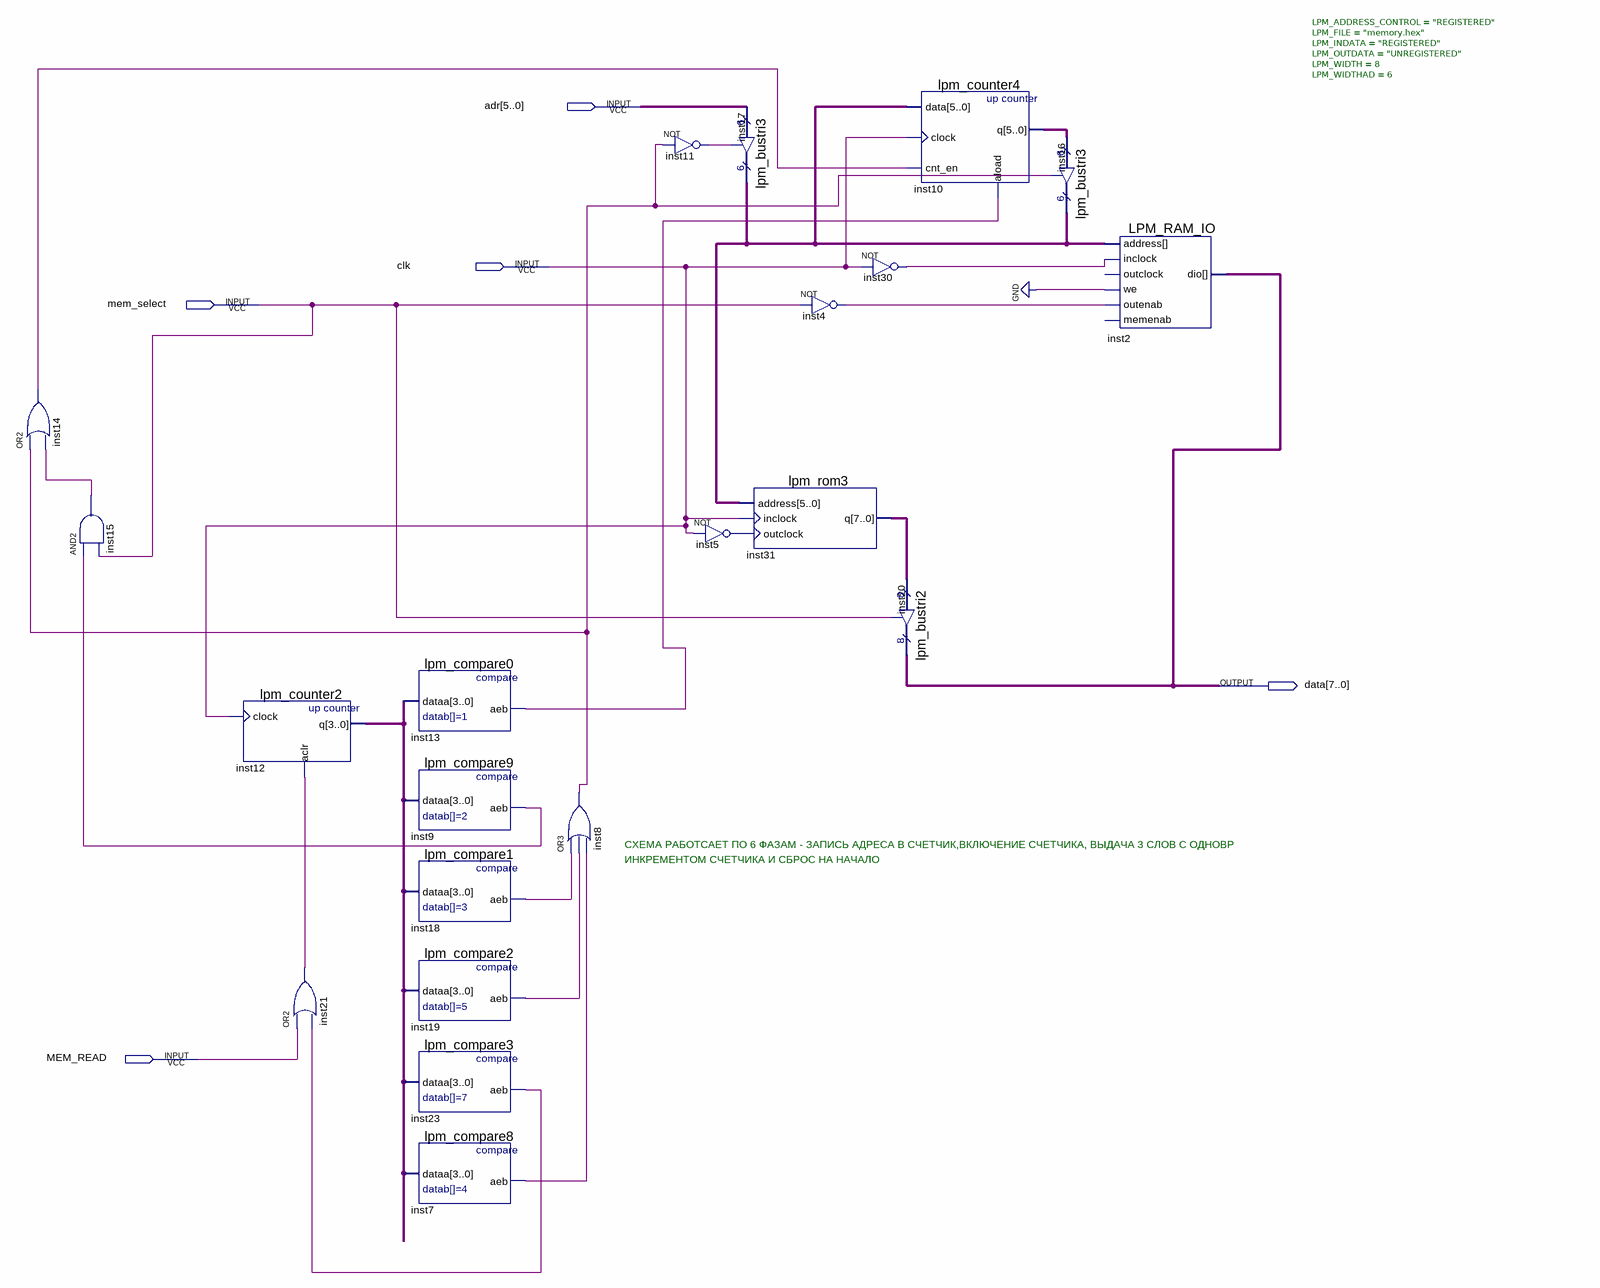
[diagram p0: schematic sheet]
// Quartus schematic memory.bdf as structural Verilog: 21 symbols, 5 pins
module memory (
  input  [5:0] adr,
  input  clk,
  input  mem_select,
  input  MEM_READ,
  output [7:0] data
);

  wire inst4_out, inst5_out, inst7_aeb, inst8_out, inst9_aeb, inst11_out, inst13_aeb, inst14_out, inst15_out,
       inst18_aeb, inst19_aeb, inst21_out, inst23_aeb, inst30_out;
  wire [3:0] inst12_q;
  wire [5:0] inst10_q, inst17_tridata;
  wire [7:0] inst31_q;

  or inst14 (inst14_out, inst8_out, inst15_out);
  and inst15 (inst15_out, inst9_aeb, mem_select);
  lpm_counter2 inst12 (.clock(clk), .aclr(inst21_out), .q(inst12_q));
  or inst21 (inst21_out, MEM_READ, inst23_aeb);
  lpm_compare0 inst13 (.dataa(inst12_q), .aeb(inst13_aeb));
  lpm_compare9 inst9 (.dataa(inst12_q), .aeb(inst9_aeb));
  lpm_compare1 inst18 (.dataa(inst12_q), .aeb(inst18_aeb));
  lpm_compare2 inst19 (.dataa(inst12_q), .aeb(inst19_aeb));
  lpm_compare3 inst23 (.dataa(inst12_q), .aeb(inst23_aeb));
  lpm_compare8 inst7 (.dataa(inst12_q), .aeb(inst7_aeb));
  or inst8 (inst8_out, inst18_aeb, inst19_aeb, inst7_aeb);
  not inst11 (inst11_out, inst8_out);
  lpm_bustri3 inst17 (.enabledt(inst11_out), .data(adr), .tridata(inst17_tridata));
  not inst5 (inst5_out, clk);
  lpm_rom3 inst31 (.address(inst17_tridata), .inclock(clk), .outclock(inst5_out), .q(inst31_q));
  not inst4 (inst4_out, mem_select);
  lpm_counter4 inst10 (.data(inst17_tridata), .clock(clk), .cnt_en(inst14_out), .aload(inst13_aeb), .q(inst10_q));
  not inst30 (inst30_out, clk);
  lpm_bustri2 inst20 (.enabledt(mem_select), .data(inst31_q), .tridata(data));
  lpm_bustri3 inst16 (.enabledt(inst8_out), .data(inst10_q), .tridata(inst17_tridata));
  LPM_RAM_IO #(.LPM_ADDRESS_CONTROL("REGISTERED"), .LPM_FILE("memory.hex"), .LPM_INDATA("REGISTERED"), .LPM_OUTDATA("UNREGISTERED"), .LPM_WIDTH(8), .LPM_WIDTHAD(6)) inst2 (
    .address(inst17_tridata), .inclock(inst30_out), .we(1'b0), .outenab(inst4_out), .dio(data));  // open: outclock, memenab

  // Notes on the sheet:
  //   СХЕМА РАБОТСАЕТ ПО 6 ФАЗАМ - ЗАПИСЬ АДРЕСА В СЧЕТЧИК,ВКЛЮЧЕНИЕ СЧЕТЧИКА, ВЫДАЧА 3 СЛОВ С ОДНОВР
  //   ИНКРЕМЕНТОМ СЧЕТЧИКА И СБРОС НА НАЧАЛО
endmodule
